# EAGLE design Motherboard V2 (EAGLE 6.6.0)
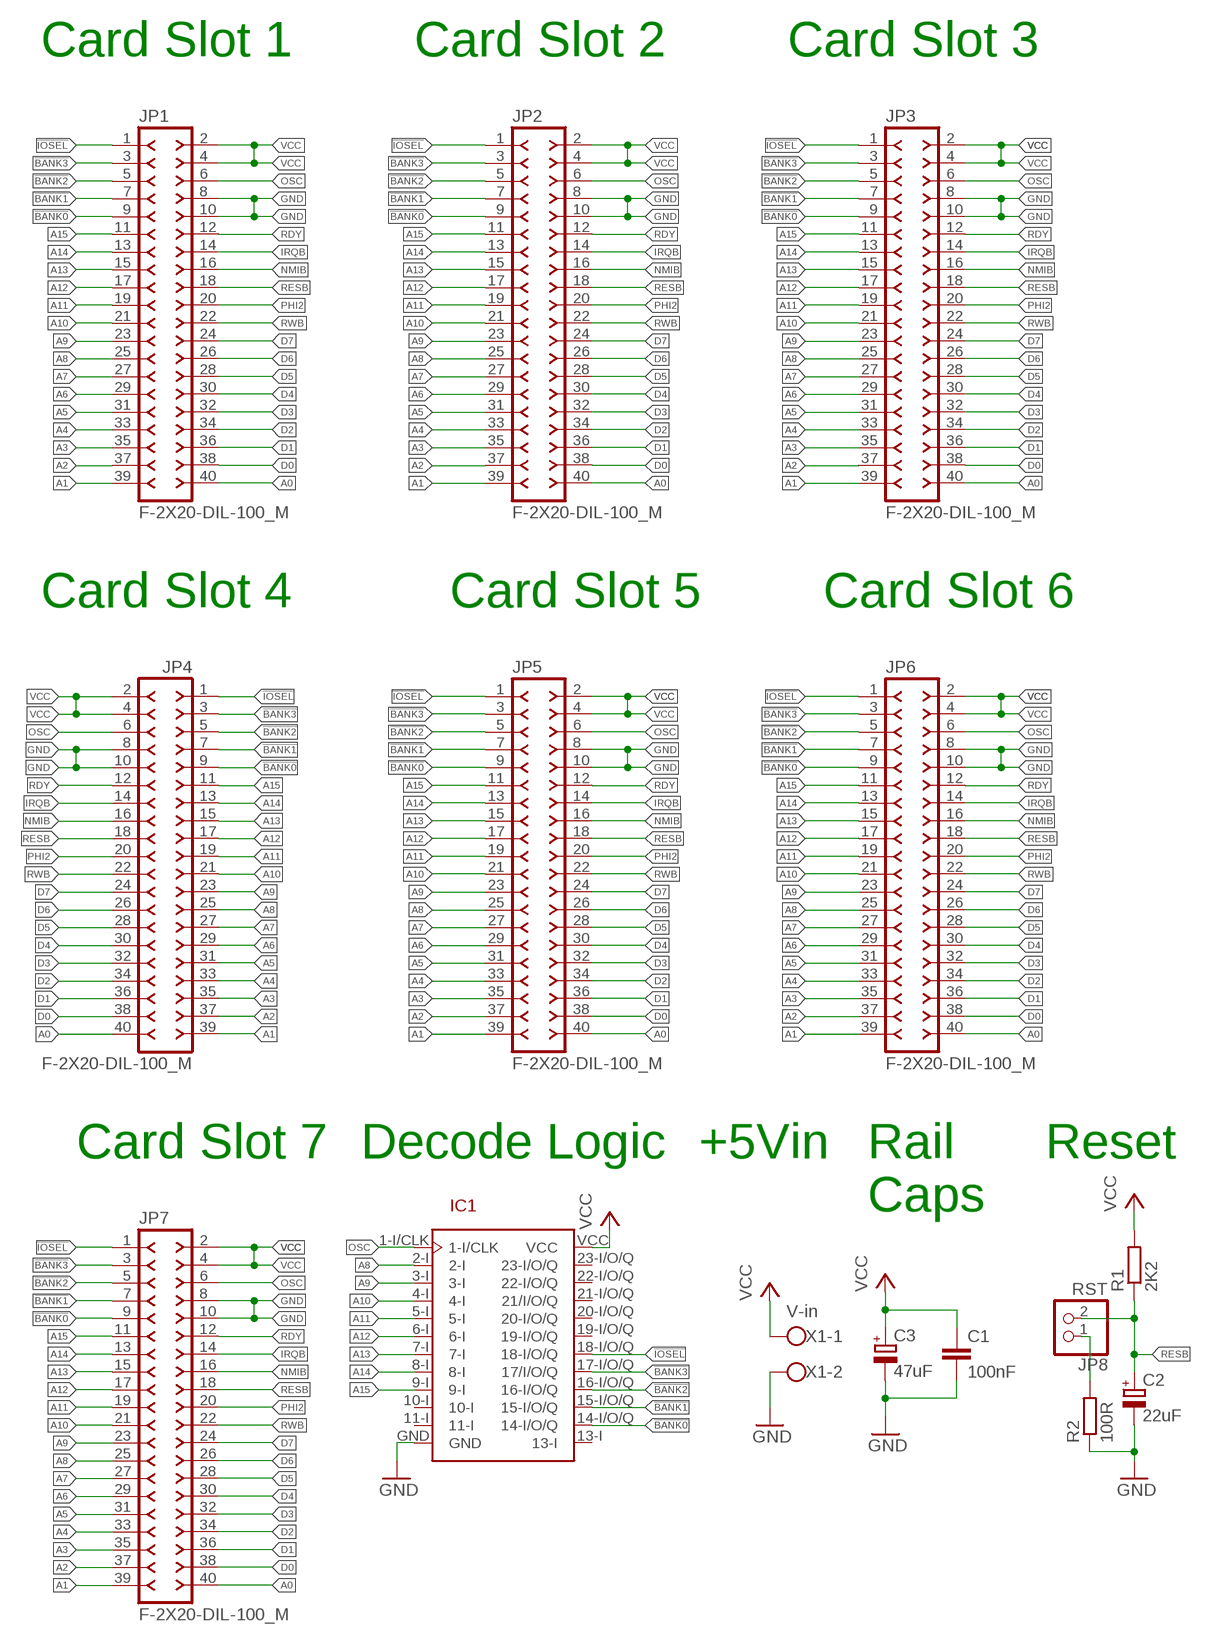
[diagram p0: schematic, sheet 1]

## Parts
C1  100nF  C-EU050-025X075  [C050-025X075]
C2  22uF  CPOL-EUE2-5  [E2-5]
C3  47uF  CPOL-EUE2.5-7  [E2,5-7]
IC1  GAL22V10D-DIP  [DIP24]
JP1  F-2X20-DIL-100_M  [DIL-100-2X20_M]
JP2  F-2X20-DIL-100_M  [DIL-100-2X20_M]
JP3  F-2X20-DIL-100_M  [DIL-100-2X20_M]
JP4  F-2X20-DIL-100_M  [DIL-100-2X20_M]
JP5  F-2X20-DIL-100_M  [DIL-100-2X20_M]
JP6  F-2X20-DIL-100_M  [DIL-100-2X20_M]
JP7  F-2X20-DIL-100_M  [DIL-100-2X20_M]
JP8  RST  PINHD-1X2  [1X02]
R1  2K2  R-EU_0207/10  [0207/10]
R2  100R  R-EU_0207/10  [0207/10]
X1  V-in  W237-102  [W237-102]

## Nets
!BANK0: IC1.14-I/O/Q JP1.9 JP2.9 JP3.9 JP4.9 JP5.9 JP6.9 JP7.9
!BANK1: IC1.15-I/O/Q JP1.7 JP2.7 JP3.7 JP4.7 JP5.7 JP6.7 JP7.7
!BANK2: IC1.16-I/O/Q JP1.5 JP2.5 JP3.5 JP4.5 JP5.5 JP6.5 JP7.5
!BANK3: IC1.17-I/O/Q(17/I/O/Q) JP1.3 JP2.3 JP3.3 JP4.3 JP5.3 JP6.3 JP7.3
!IOSEL: IC1.18-I/O/Q JP1.1 JP2.1 JP3.1 JP4.1 JP5.1 JP6.1 JP7.1
A0: JP1.40 JP2.40 JP3.40 JP4.40 JP5.40 JP6.40 JP7.40
A1: JP1.39 JP2.39 JP3.39 JP4.39 JP5.39 JP6.39 JP7.39
A2: JP1.37 JP2.37 JP3.37 JP4.37 JP5.37 JP6.37 JP7.37
A3: JP1.35 JP2.35 JP3.35 JP4.35 JP5.35 JP6.35 JP7.35
A4: JP1.33 JP2.33 JP3.33 JP4.33 JP5.33 JP6.33 JP7.33
A5: JP1.31 JP2.31 JP3.31 JP4.31 JP5.31 JP6.31 JP7.31
A6: JP1.29 JP2.29 JP3.29 JP4.29 JP5.29 JP6.29 JP7.29
A7: JP1.27 JP2.27 JP3.27 JP4.27 JP5.27 JP6.27 JP7.27
A8: IC1.2-I JP1.25 JP2.25 JP3.25 JP4.25 JP5.25 JP6.25 JP7.25
A9: IC1.3-I JP1.23 JP2.23 JP3.23 JP4.23 JP5.23 JP6.23 JP7.23
A10: IC1.4-I JP1.21 JP2.21 JP3.21 JP4.21 JP5.21 JP6.21 JP7.21
A11: IC1.5-I JP1.19 JP2.19 JP3.19 JP4.19 JP5.19 JP6.19 JP7.19
A12: IC1.6-I JP1.17 JP2.17 JP3.17 JP4.17 JP5.17 JP6.17 JP7.17
A13: IC1.7-I JP1.15 JP2.15 JP3.15 JP4.15 JP5.15 JP6.15 JP7.15
A14: IC1.8-I JP1.13 JP2.13 JP3.13 JP4.13 JP5.13 JP6.13 JP7.13
A15: IC1.9-I JP1.11 JP2.11 JP3.11 JP4.11 JP5.11 JP6.11 JP7.11
D0: JP1.38 JP2.38 JP3.38 JP4.38 JP5.38 JP6.38 JP7.38
D1: JP1.36 JP2.36 JP3.36 JP4.36 JP5.36 JP6.36 JP7.36
D2: JP1.34 JP2.34 JP3.34 JP4.34 JP5.34 JP6.34 JP7.34
D3: JP1.32 JP2.32 JP3.32 JP4.32 JP5.32 JP6.32 JP7.32
D4: JP1.30 JP2.30 JP3.30 JP4.30 JP5.30 JP6.30 JP7.30
D5: JP1.28 JP2.28 JP3.28 JP4.28 JP5.28 JP6.28 JP7.28
D6: JP1.26 JP2.26 JP3.26 JP4.26 JP5.26 JP6.26 JP7.26
D7: JP1.24 JP2.24 JP3.24 JP4.24 JP5.24 JP6.24 JP7.24
GND: C1.2 C2.- C3.- IC1.GND JP1.8 JP1.10 JP2.8 JP2.10 JP3.8 JP3.10 JP4.8 JP4.10 JP5.8 JP5.10 JP6.8 JP6.10 JP7.8 JP7.10 R2.1 X1.2
IRQB: JP1.14 JP2.14 JP3.14 JP4.14 JP5.14 JP6.14 JP7.14
N$1: JP8.1 R2.2
NMIB: JP1.16 JP2.16 JP3.16 JP4.16 JP5.16 JP6.16 JP7.16
OSC: IC1.1-I/CLK JP1.6 JP2.6 JP3.6 JP4.6 JP5.6 JP6.6 JP7.6
PHI2: JP1.20 JP2.20 JP3.20 JP4.20 JP5.20 JP6.20 JP7.20
RDY: JP1.12 JP2.12 JP3.12 JP4.12 JP5.12 JP6.12 JP7.12
RESB: C2.+ JP1.18 JP2.18 JP3.18 JP4.18 JP5.18 JP6.18 JP7.18 JP8.2 R1.1
RWB: JP1.22 JP2.22 JP3.22 JP4.22 JP5.22 JP6.22 JP7.22
VCC: C1.1 C3.+ IC1.VCC JP1.2 JP1.4 JP2.2 JP2.4 JP3.2 JP3.4 JP4.2 JP4.4 JP5.2 JP5.4 JP6.2 JP6.4 JP7.2 JP7.4 R1.2 X1.1
Unconnected: IC1.10-I IC1.11-I IC1.13-I IC1.19-I/O/Q IC1.20-I/O/Q IC1.21-I/O/Q(21/I/O/Q) IC1.22-I/O/Q IC1.23-I/O/Q

## Notes on the sheet
- Card Slot 1 | Card Slot 2 | Card Slot 3
- Card Slot 4 | Card Slot 5 | Card Slot 6
- Rail
  Caps
- Card Slot 7 | Decode Logic | +5Vin | Reset

## Library data of the parts
C1 = rcl:C-EU: CAPACITOR, European symbol
C2 C3 = rcl:CPOL-EU: POLARIZED CAPACITOR, European symbol
IC1 = GAL22V10D:GAL22V10D-DIP: GAL22V10 Generic Array Logic
JP1-JP7 = con-headers-jp:F-2X20-: FEMALE HEADER
JP8 = pinhead:PINHD-1X2: PIN HEADER
R1 R2 = rcl:R-EU_: RESISTOR, European symbol
X1 = con-wago-500:W237-102: WAGO SCREW CLAMP; MPN: 237-102; OC_FARNELL: unknown; OC_NEWARK: 70K9898

## Board
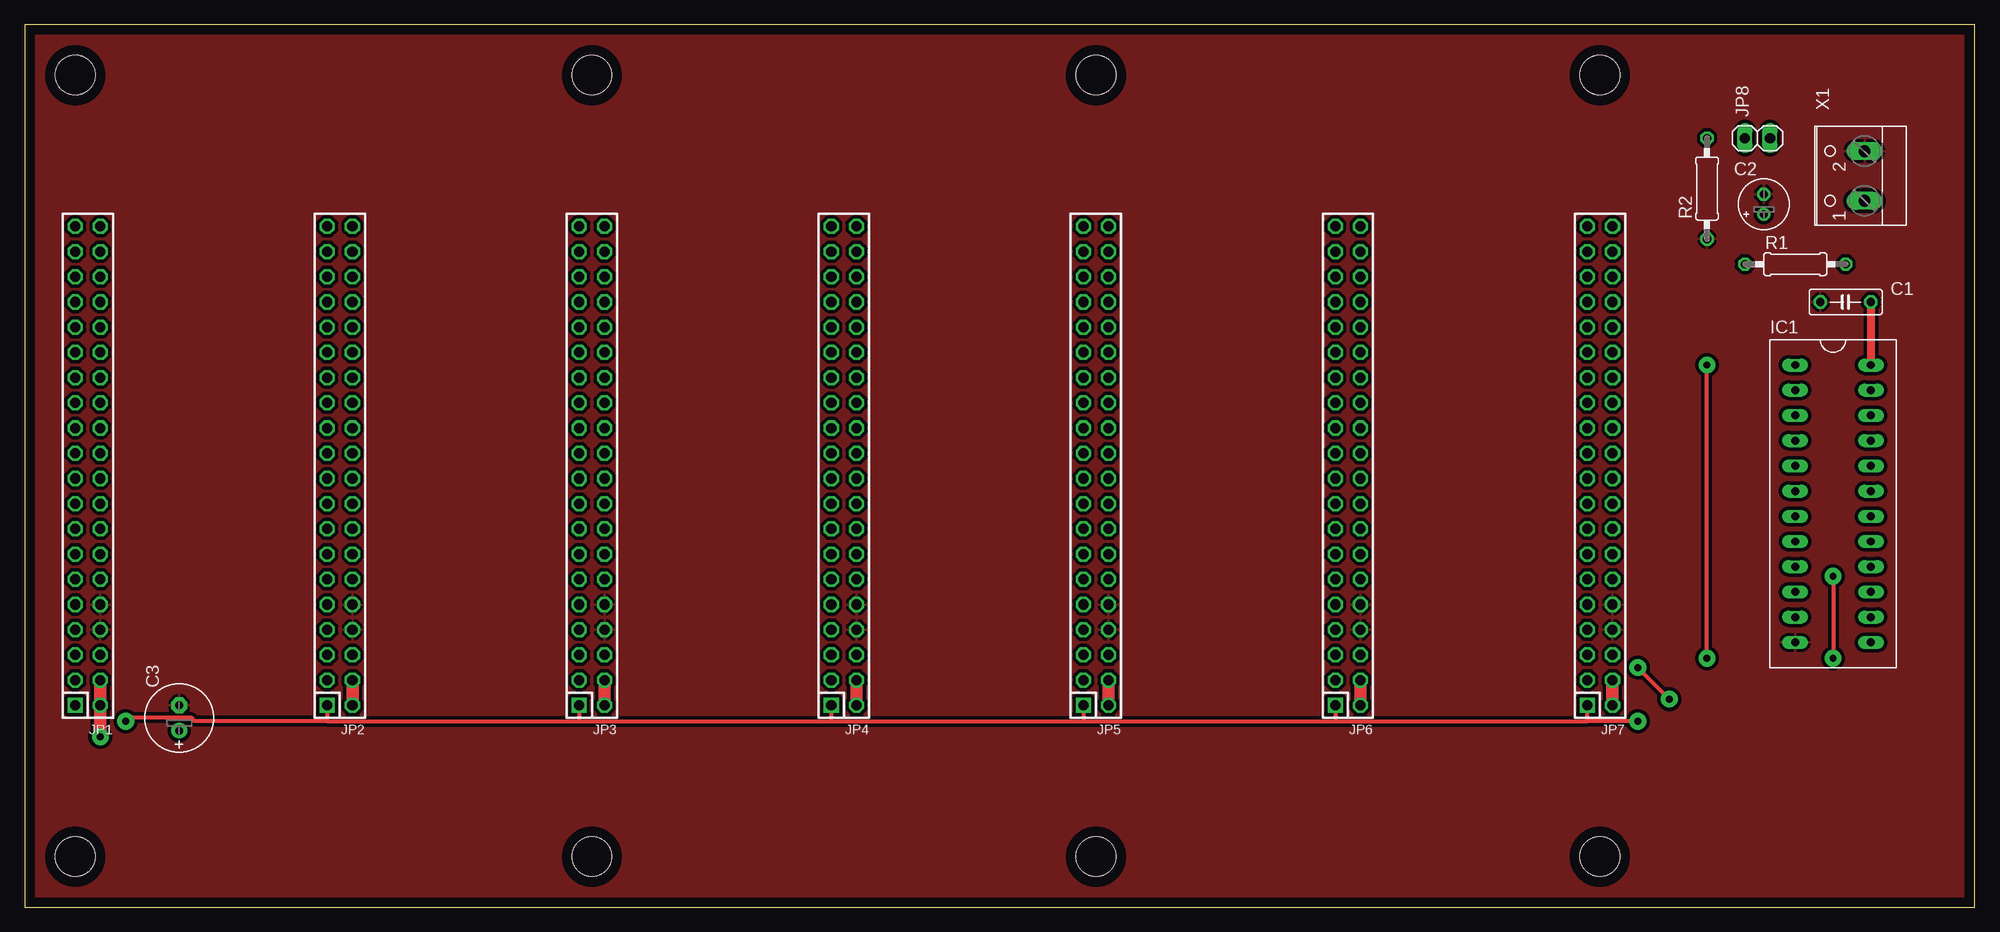
[diagram p1: board, top side]
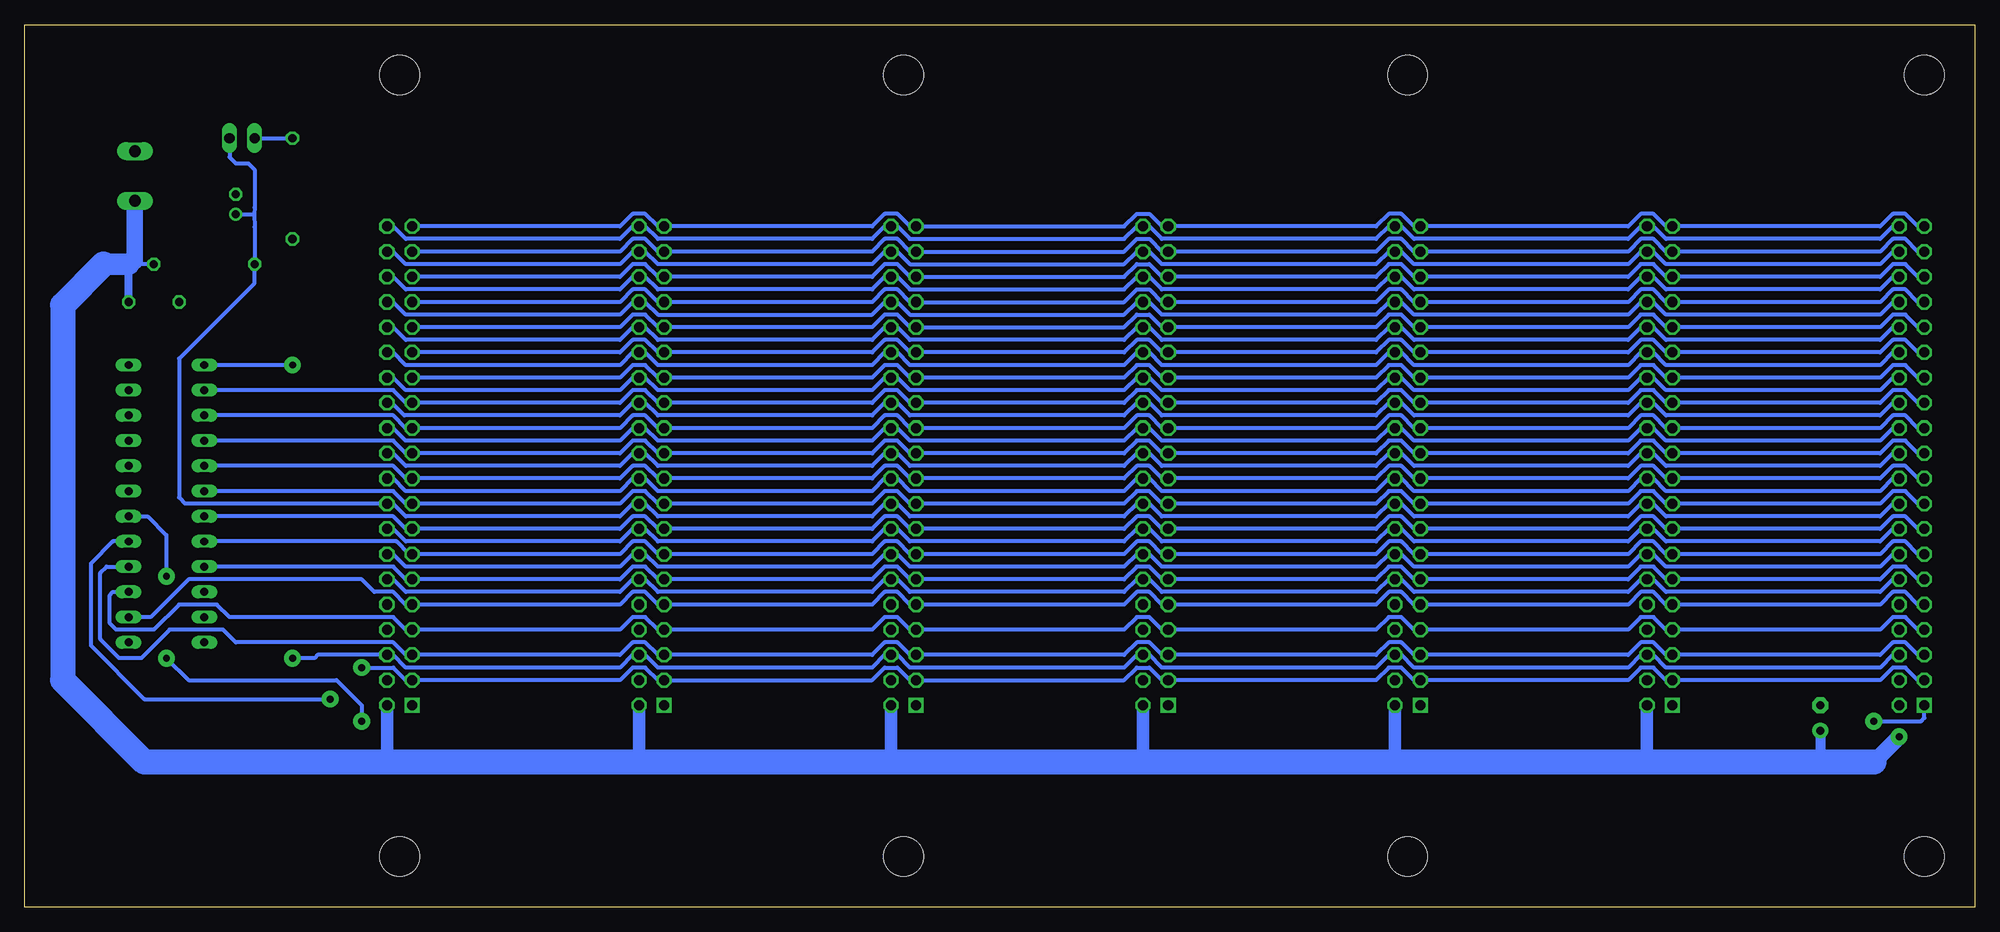
[diagram p2: board, bottom side, seen from below]

Size 196.52 x 88.89 mm. Coordinates in mm from the lower left corner, seen from the top.
Outline: 0,0 196.52,0 196.52,88.89 0,88.89 0,0
Copper layers (1*16): Top 0.035mm / dielectric 1.5mm / Bottom 0.035mm
Design rules "default *": minimum track width 10mil, minimum drill 24mil, track to track 8mil, track to pad 8mil, pad to pad 8mil, via to via 8mil, smd to smd 8mil, copper to edge 40mil, drill to drill 8mil, minimum pad ring 10mil, minimum via ring 8mil, stop-mask expansion 4mil, vias tented up to drill 0mil, thermal gap 12mil
Holes 4 mm at 5.08,5.08 5.08,83.82 158.75,83.82 158.75,5.08 57.15,5.08 57.15,83.82 107.95,5.08 107.95,83.82

### Footprints (pad centres in the part's own frame; a part is rotated, then mirrored left to right if it is on the bottom)
C050-025X075 = drill 0.813 octagon: 1 -2.54,0; 2 2.54,0
E2-5 = drill 0.813 pad 1.27: + -1.016,0 | drill 0.813 pad 1.27 octagon: - 1.016,0
E2,5-7 = drill 0.813 pad 1.6: + -1.27,0 | drill 0.813 pad 1.6 octagon: - 1.27,0
DIP24 = drill 0.8 long: 1-I/CLK -3.81,13.97; 2-I -3.81,11.43; 3-I -3.81,8.89; 4-I -3.81,6.35; 5-I -3.81,3.81; 6-I -3.81,1.27; 7-I -3.81,-1.27; 8-I -3.81,-3.81; 9-I -3.81,-6.35; 10-I -3.81,-8.89; 11-I -3.81,-11.43; 13-I 3.81,-13.97; 14-I/O/Q 3.81,-11.43; 15-I/O/Q 3.81,-8.89; 16-I/O/Q 3.81,-6.35; 17-I/O/Q 3.81,-3.81; 18-I/O/Q 3.81,-1.27; 19-I/O/Q 3.81,1.27; 20-I/O/Q 3.81,3.81; 21-I/O/Q 3.81,6.35; 22-I/O/Q 3.81,8.89; 23-I/O/Q 3.81,11.43; GND -3.81,-13.97; VCC 3.81,13.97
DIL-100-2X20_M = drill 1.016 square: 1 -24.13,1.27 | drill 1.016 octagon: 2 -24.13,-1.27; 3 -21.59,1.27; 4 -21.59,-1.27; 5 -19.05,1.27; 6 -19.05,-1.27; 7 -16.51,1.27; 8 -16.51,-1.27; 9 -13.97,1.27; 10 -13.97,-1.27; 11 -11.43,1.27; 12 -11.43,-1.27; 13 -8.89,1.27; 14 -8.89,-1.27; 15 -6.35,1.27; 16 -6.35,-1.27; 17 -3.81,1.27; 18 -3.81,-1.27; 19 -1.27,1.27; 20 -1.27,-1.27; 21 1.27,1.27; 22 1.27,-1.27; 23 3.81,1.27; 24 3.81,-1.27; 25 6.35,1.27; 26 6.35,-1.27; 27 8.89,1.27; 28 8.89,-1.27; 29 11.43,1.27; 30 11.43,-1.27; 31 13.97,1.27; 32 13.97,-1.27; 33 16.51,1.27; 34 16.51,-1.27; 35 19.05,1.27; 36 19.05,-1.27; 37 21.59,1.27; 38 21.59,-1.27; 39 24.13,1.27; 40 24.13,-1.27
1X02 = drill 1.016 long: 1 -1.27,0; 2 1.27,0
0207/10 = drill 0.813 octagon: 1 -5.08,0; 2 5.08,0
W237-102 = drill 1.194 long: 1 -2.5,-1.27; 2 2.5,-1.27

### Placement (x,y rotation side)
C1  183.51,60.96 180 top
C2  175.26,70.8 90 top
C3  15.56,19.05 90 top
IC1  182.25,40.64 0 top
JP1  6.35,44.45 90 top
JP2  31.75,44.45 90 top
JP3  57.15,44.45 90 top
JP4  82.55,44.45 90 top
JP5  107.95,44.45 90 top
JP6  133.35,44.45 90 top
JP7  158.75,44.45 90 top
JP8  174.62,77.47 0 top
R1  178.44,64.77 0 top
R2  169.54,72.39 90 top
X1  184.15,73.66 90 top

### Tracks (layer width: path | path; a pad name or v marks a point on that pad's centre or on a via)
!BANK0
  Bottom 0.406: IC1.14-I/O/Q 183.83,29.21 180.02,33.02 162.56,33.02 161.29,31.75 159.38,31.75 158.12,30.48 JP7.9 136.53,30.48 135.25,31.75 133.99,31.75 132.72,30.48 JP6.9 111.12,30.48 109.86,31.75 108.58,31.75 107.31,30.48 JP5.9 85.72,30.48 84.45,31.75 83.19,31.75 81.92,30.48 JP4.9 60.33,30.48 59.05,31.75 57.78,31.75 56.52,30.48 JP3.9 34.92,30.48 33.66,31.75 32.38,31.75 31.11,30.48 JP2.9 9.53,30.48 8.26,31.75 6.99,31.75 5.71,30.48 JP1.9
!BANK1
  Bottom 0.406: IC1.15-I/O/Q 187.64,31.75 187.96,31.43 187.96,28.57 187.32,27.94 183.51,27.94 180.97,30.48 177.16,30.48 175.9,29.21 159.38,29.21 158.12,27.94 JP7.7 136.53,27.94 135.25,29.21 133.99,29.21 132.72,27.94 JP6.7 111.12,27.94 109.86,29.21 108.58,29.21 107.31,27.94 JP5.7 85.72,27.94 84.45,29.21 83.19,29.21 81.92,27.94 JP4.7 60.33,27.94 59.05,29.21 57.78,29.21 56.52,27.94 JP3.7 34.92,27.94 33.66,29.21 32.38,29.21 31.11,27.94 JP2.7 9.53,27.94 8.26,29.21 6.99,29.21 5.71,27.94 JP1.7
!BANK2
  Bottom 0.406: IC1.16-I/O/Q 188.28,34.29 188.91,33.66 188.91,26.99 187.01,25.08 184.78,25.08 181.93,27.94 176.53,27.94 175.26,26.67 159.38,26.67 158.12,25.4 JP7.5 136.53,25.4 135.25,26.67 133.99,26.67 132.72,25.4 JP6.5 111.12,25.4 109.86,26.67 108.58,26.67 107.31,25.4 JP5.5 85.72,25.4 84.45,26.67 83.19,26.67 81.92,25.4 JP4.5 60.33,25.4 59.05,26.67 57.78,26.67 56.52,25.4 JP3.5 34.92,25.4 33.66,26.67 32.38,26.67 31.11,25.4 JP2.5 9.53,25.4 8.26,26.67 6.99,26.67 5.71,25.4 JP1.5
!BANK3  (via drill 0.7 pad 1.7)
  Top 0.406: v165.74,20.95 v162.56,24.13
  Bottom 0.406: JP1.3 5.71,22.86 6.99,24.13 8.26,24.13 9.53,22.86 JP2.3 31.11,22.86 32.38,24.13 33.66,24.13 34.92,22.86 JP3.3 56.52,22.86 57.78,24.13 59.05,24.13 60.33,22.86 JP4.3 81.92,22.86 83.19,24.13 84.45,24.13 85.72,22.86 JP5.3 107.31,22.86 108.58,24.13 109.86,24.13 111.12,22.86 JP6.3 132.72,22.86 133.99,24.13 135.25,24.13 136.53,22.86 JP7.3 158.12,22.86 159.38,24.13 v162.56,24.13 | IC1.17-I/O/Q 187.64,36.83 189.87,34.61 189.87,26.35 184.47,20.95 v165.74,20.95
!IOSEL  (via drill 0.7 pad 1.7)
  Top 0.406: JP2.1 30.48,18.73 | 30.48,18.73 55.88,18.73 | 55.88,18.73 81.28,18.73 | 81.28,18.73 106.68,18.73 | 106.68,18.73 132.08,18.73 | 132.08,18.73 157.48,18.73 | 157.48,18.73 JP7.1 | JP6.1 132.08,18.73 | JP5.1 106.68,18.73 | JP4.1 81.28,18.73 | JP3.1 55.88,18.73 | 30.48,18.73 17.14,18.73 16.83,19.05 10.48,19.05 v10.16,18.73 | v162.56,18.73 157.48,18.73 | v182.25,33.34 v182.25,25.08
  Bottom 0.406: v10.16,18.73 5.4,18.73 5.08,19.05 JP1.1 | v182.25,25.08 180.02,22.86 165.1,22.86 162.56,20.32 v162.56,18.73 | IC1.18-I/O/Q 184.15,39.37 182.25,37.47 v182.25,33.34
A0
  Bottom 0.406: JP1.40 8.26,68.58 9.53,67.31 31.11,67.31 32.38,68.58 JP2.40 33.66,68.58 34.92,67.31 56.52,67.31 57.78,68.58 JP3.40 59.05,68.58 60.33,67.31 81.92,67.31 83.19,68.58 JP4.40 84.45,68.58 85.72,67.31 107.31,67.31 108.58,68.58 JP5.40 109.86,68.58 111.12,67.31 132.72,67.31 133.99,68.58 JP6.40 135.25,68.58 136.53,67.31 158.12,67.31 159.38,68.58 JP7.40
A1
  Bottom 0.406: JP1.39 5.71,68.58 6.99,69.85 8.26,69.85 9.53,68.58 JP2.39 31.11,68.58 32.38,69.85 33.66,69.85 34.92,68.58 JP3.39 56.52,68.58 57.78,69.85 59.05,69.85 60.33,68.58 JP4.39 81.92,68.58 83.19,69.85 84.45,69.85 85.72,68.58 JP5.39 107.31,68.58 108.58,69.85 109.86,69.85 111.12,68.58 JP6.39 132.72,68.58 133.99,69.85 135.25,69.85 136.53,68.58 JP7.39
A2
  Bottom 0.406: JP1.37 5.71,66.04 6.99,67.31 8.26,67.31 9.53,66.04 JP2.37 31.11,66.04 32.38,67.31 33.66,67.31 34.92,66.04 JP3.37 56.52,66.04 57.78,67.31 59.05,67.31 60.33,66.04 JP4.37 81.92,66.04 83.19,67.31 84.45,67.31 85.72,66.04 JP5.37 107.31,66.04 108.58,67.31 109.86,67.31 111.12,66.04 JP6.37 132.72,66.04 133.99,67.31 135.25,67.31 136.53,66.04 JP7.37
A3
  Bottom 0.406: JP1.35 5.71,63.5 6.99,64.77 8.26,64.77 9.53,63.5 JP2.35 31.11,63.5 32.38,64.77 33.66,64.77 34.92,63.5 JP3.35 56.52,63.5 57.78,64.77 59.05,64.77 60.33,63.5 JP4.35 81.92,63.5 83.19,64.77 84.45,64.77 85.72,63.5 JP5.35 107.31,63.5 108.58,64.77 109.86,64.77 111.12,63.5 JP6.35 132.72,63.5 133.99,64.77 135.25,64.77 136.53,63.5 JP7.35
A4
  Bottom 0.406: JP1.33 5.71,60.96 6.99,62.23 8.26,62.23 9.53,60.96 JP2.33 31.11,60.96 32.38,62.23 33.66,62.23 34.92,60.96 JP3.33 56.52,60.96 57.78,62.23 59.05,62.23 60.33,60.96 JP4.33 81.92,60.96 83.19,62.23 84.45,62.23 85.72,60.96 JP5.33 107.31,60.96 108.58,62.23 109.86,62.23 111.12,60.96 JP6.33 132.72,60.96 133.99,62.23 135.25,62.23 136.53,60.96 JP7.33
A5
  Bottom 0.406: JP1.31 5.71,58.42 6.99,59.69 8.26,59.69 9.53,58.42 JP2.31 31.11,58.42 32.38,59.69 33.66,59.69 34.92,58.42 JP3.31 56.52,58.42 57.78,59.69 59.05,59.69 60.33,58.42 JP4.31 81.92,58.42 83.19,59.69 84.45,59.69 85.72,58.42 JP5.31 107.31,58.42 108.58,59.69 109.86,59.69 111.12,58.42 JP6.31 132.72,58.42 133.99,59.69 135.25,59.69 136.53,58.42 JP7.31
A6
  Bottom 0.406: JP1.29 5.71,55.88 6.99,57.15 8.26,57.15 9.53,55.88 JP2.29 31.11,55.88 32.38,57.15 33.66,57.15 34.92,55.88 JP3.29 56.52,55.88 57.78,57.15 59.05,57.15 60.33,55.88 JP4.29 81.92,55.88 83.19,57.15 84.45,57.15 85.72,55.88 JP5.29 107.31,55.88 108.58,57.15 109.86,57.15 111.12,55.88 JP6.29 132.72,55.88 133.99,57.15 135.25,57.15 136.53,55.88 JP7.29
A7
  Bottom 0.406: JP1.27 5.71,53.34 6.99,54.61 8.26,54.61 9.53,53.34 JP2.27 31.11,53.34 32.38,54.61 33.66,54.61 34.92,53.34 JP3.27 56.52,53.34 57.78,54.61 59.05,54.61 60.33,53.34 JP4.27 81.92,53.34 83.19,54.61 84.45,54.61 85.72,53.34 JP5.27 107.31,53.34 108.58,54.61 109.86,54.61 111.12,53.34 JP6.27 132.72,53.34 133.99,54.61 135.25,54.61 136.53,53.34 JP7.27
A8
  Bottom 0.406: JP1.25 5.71,50.8 6.99,52.07 8.26,52.07 9.53,50.8 JP2.25 31.11,50.8 32.38,52.07 33.66,52.07 34.92,50.8 JP3.25 56.52,50.8 57.78,52.07 59.05,52.07 60.33,50.8 JP4.25 81.92,50.8 83.19,52.07 84.45,52.07 85.72,50.8 JP5.25 107.31,50.8 108.58,52.07 109.86,52.07 111.12,50.8 JP6.25 132.72,50.8 133.99,52.07 135.25,52.07 136.53,50.8 JP7.25 158.12,50.8 159.38,52.07 IC1.2-I
A9
  Bottom 0.406: JP1.23 5.71,48.26 6.99,49.53 8.26,49.53 9.53,48.26 JP2.23 31.11,48.26 32.38,49.53 33.66,49.53 34.92,48.26 JP3.23 56.52,48.26 57.78,49.53 59.05,49.53 60.33,48.26 JP4.23 81.92,48.26 83.19,49.53 84.45,49.53 85.72,48.26 JP5.23 107.31,48.26 108.58,49.53 109.86,49.53 111.12,48.26 JP6.23 132.72,48.26 133.99,49.53 135.25,49.53 136.53,48.26 JP7.23 158.12,48.26 159.38,49.53 IC1.3-I
A10
  Bottom 0.406: JP1.21 5.71,45.72 6.99,46.99 8.26,46.99 9.53,45.72 JP2.21 31.11,45.72 32.38,46.99 33.66,46.99 34.92,45.72 JP3.21 56.52,45.72 57.78,46.99 59.05,46.99 60.33,45.72 JP4.21 81.92,45.72 83.19,46.99 84.45,46.99 85.72,45.72 JP5.21 107.31,45.72 108.58,46.99 109.86,46.99 111.12,45.72 JP6.21 132.72,45.72 133.99,46.99 135.25,46.99 136.53,45.72 JP7.21 158.12,45.72 159.38,46.99 IC1.4-I
A11
  Bottom 0.406: JP1.19 5.71,43.18 6.99,44.45 8.26,44.45 9.53,43.18 JP2.19 31.11,43.18 32.38,44.45 33.66,44.45 34.92,43.18 JP3.19 56.52,43.18 57.78,44.45 59.05,44.45 60.33,43.18 JP4.19 81.92,43.18 83.19,44.45 84.45,44.45 85.72,43.18 JP5.19 107.31,43.18 108.58,44.45 109.86,44.45 111.12,43.18 JP6.19 132.72,43.18 133.99,44.45 135.25,44.45 136.53,43.18 JP7.19 158.12,43.18 159.38,44.45 IC1.5-I
A12
  Bottom 0.406: JP1.17 5.71,40.64 6.99,41.91 8.26,41.91 9.53,40.64 JP2.17 31.11,40.64 32.38,41.91 33.66,41.91 34.92,40.64 JP3.17 56.52,40.64 57.78,41.91 59.05,41.91 60.33,40.64 JP4.17 81.92,40.64 83.19,41.91 84.45,41.91 85.72,40.64 JP5.17 107.31,40.64 108.58,41.91 109.86,41.91 111.12,40.64 JP6.17 132.72,40.64 133.99,41.91 135.25,41.91 136.53,40.64 JP7.17 158.12,40.64 159.38,41.91 IC1.6-I
A13
  Bottom 0.406: JP1.15 5.71,38.1 6.99,39.37 8.26,39.37 9.53,38.1 JP2.15 31.11,38.1 32.38,39.37 33.66,39.37 34.92,38.1 JP3.15 56.52,38.1 57.78,39.37 59.05,39.37 60.33,38.1 JP4.15 81.92,38.1 83.19,39.37 84.45,39.37 85.72,38.1 JP5.15 107.31,38.1 108.58,39.37 109.86,39.37 111.12,38.1 JP6.15 132.72,38.1 133.99,39.37 135.25,39.37 136.53,38.1 JP7.15 158.12,38.1 159.38,39.37 IC1.7-I
A14
  Bottom 0.406: JP1.13 5.71,35.56 6.99,36.83 8.26,36.83 9.53,35.56 JP2.13 31.11,35.56 32.38,36.83 33.66,36.83 34.92,35.56 JP3.13 56.52,35.56 57.78,36.83 59.05,36.83 60.33,35.56 JP4.13 81.92,35.56 83.19,36.83 84.45,36.83 85.72,35.56 JP5.13 107.31,35.56 108.58,36.83 109.86,36.83 111.12,35.56 JP6.13 132.72,35.56 133.99,36.83 135.25,36.83 136.53,35.56 JP7.13 157.8,35.56 159.07,36.83 IC1.8-I
A15
  Bottom 0.406: JP1.11 5.71,33.02 6.99,34.29 8.26,34.29 9.53,33.02 JP2.11 31.11,33.02 32.38,34.29 33.66,34.29 34.92,33.02 JP3.11 56.52,33.02 57.78,34.29 59.05,34.29 60.33,33.02 JP4.11 81.92,33.02 83.19,34.29 84.45,34.29 85.72,33.02 JP5.11 107.31,33.02 108.58,34.29 109.86,34.29 111.12,33.02 JP6.11 132.72,33.02 133.99,34.29 135.25,34.29 136.53,33.02 JP7.11 158.12,33.02 159.38,34.29 IC1.9-I
D0
  Bottom 0.406: JP1.38 8.26,66.04 9.53,64.77 31.11,64.77 32.38,66.04 JP2.38 33.66,66.04 34.92,64.77 56.52,64.77 57.78,66.04 JP3.38 59.05,66.04 60.33,64.77 81.92,64.77 83.19,66.04 JP4.38 84.45,66.04 85.72,64.77 107.31,64.77 108.58,66.04 JP5.38 109.86,66.04 111.12,64.77 132.72,64.77 133.99,66.04 JP6.38 135.25,66.04 136.53,64.77 158.12,64.77 159.38,66.04 JP7.38
D1
  Bottom 0.406: JP1.36 8.26,63.5 9.53,62.23 31.11,62.23 32.38,63.5 JP2.36 33.66,63.5 34.92,62.23 56.52,62.23 57.78,63.5 JP3.36 59.05,63.5 60.33,62.23 81.92,62.23 83.19,63.5 JP4.36 84.45,63.5 85.72,62.23 107.31,62.23 108.58,63.5 JP5.36 109.86,63.5 111.12,62.23 132.72,62.23 133.99,63.5 JP6.36 135.25,63.5 136.53,62.23 158.12,62.23 159.38,63.5 JP7.36
D2
  Bottom 0.406: JP1.34 8.26,60.96 9.53,59.69 31.11,59.69 32.38,60.96 JP2.34 33.66,60.96 34.92,59.69 56.52,59.69 57.78,60.96 JP3.34 59.05,60.96 60.33,59.69 81.92,59.69 83.19,60.96 JP4.34 84.45,60.96 85.72,59.69 107.31,59.69 108.58,60.96 JP5.34 109.86,60.96 111.12,59.69 132.72,59.69 133.99,60.96 JP6.34 135.25,60.96 136.53,59.69 158.12,59.69 159.38,60.96 JP7.34
D3
  Bottom 0.406: JP1.32 8.26,58.42 9.53,57.15 31.11,57.15 32.38,58.42 JP2.32 33.66,58.42 34.92,57.15 56.52,57.15 57.78,58.42 JP3.32 59.05,58.42 60.33,57.15 81.92,57.15 83.19,58.42 JP4.32 84.45,58.42 85.72,57.15 107.31,57.15 108.58,58.42 JP5.32 109.86,58.42 111.12,57.15 132.72,57.15 133.99,58.42 JP6.32 135.25,58.42 136.53,57.15 158.12,57.15 159.38,58.42 JP7.32
D4
  Bottom 0.406: JP1.30 8.26,55.88 9.53,54.61 31.11,54.61 32.38,55.88 JP2.30 33.66,55.88 34.92,54.61 56.52,54.61 57.78,55.88 JP3.30 59.05,55.88 60.33,54.61 81.92,54.61 83.19,55.88 JP4.30 84.45,55.88 85.72,54.61 107.31,54.61 108.58,55.88 JP5.30 109.86,55.88 111.12,54.61 132.72,54.61 133.99,55.88 JP6.30 135.25,55.88 136.53,54.61 158.12,54.61 159.38,55.88 JP7.30
D5
  Bottom 0.406: JP1.28 8.26,53.34 9.53,52.07 31.11,52.07 32.38,53.34 JP2.28 33.66,53.34 34.92,52.07 56.52,52.07 57.78,53.34 JP3.28 59.05,53.34 60.33,52.07 81.92,52.07 83.19,53.34 JP4.28 84.45,53.34 85.72,52.07 107.31,52.07 108.58,53.34 JP5.28 109.86,53.34 111.12,52.07 132.72,52.07 133.99,53.34 JP6.28 135.25,53.34 136.53,52.07 158.12,52.07 159.38,53.34 JP7.28
D6
  Bottom 0.406: JP1.26 8.26,50.8 9.53,49.53 31.11,49.53 32.38,50.8 JP2.26 33.66,50.8 34.92,49.53 56.52,49.53 57.78,50.8 JP3.26 59.05,50.8 60.33,49.53 81.92,49.53 83.19,50.8 JP4.26 84.45,50.8 85.72,49.53 107.31,49.53 108.58,50.8 JP5.26 109.86,50.8 111.12,49.53 132.72,49.53 133.99,50.8 JP6.26 135.25,50.8 136.53,49.53 158.27,49.53 159.54,50.8 JP7.26
D7
  Bottom 0.406: JP1.24 8.26,48.26 9.53,46.99 31.11,46.99 32.38,48.26 JP2.24 33.66,48.26 34.92,46.99 56.52,46.99 57.78,48.26 JP3.24 59.05,48.26 60.33,46.99 81.92,46.99 83.19,48.26 JP4.24 84.45,48.26 85.72,46.99 107.31,46.99 108.58,48.26 JP5.24 109.86,48.26 111.12,46.99 132.72,46.99 133.99,48.26 JP6.24 135.25,48.26 136.53,46.99 158.12,46.99 159.38,48.26 JP7.24
GND
  pour Top (isolate 0.356): 196.53,88.9 196.53,0 0,0 0,88.9
IRQB
  Bottom 0.406: JP1.14 8.26,35.56 9.53,34.29 31.11,34.29 32.38,35.56 JP2.14 33.66,35.56 34.92,34.29 56.52,34.29 57.78,35.56 JP3.14 59.05,35.56 60.33,34.29 81.92,34.29 83.19,35.56 JP4.14 84.45,35.56 85.72,34.29 107.31,34.29 108.58,35.56 JP5.14 109.86,35.56 111.12,34.29 132.72,34.29 133.99,35.56 JP6.14 135.25,35.56 136.53,34.29 158.12,34.29 159.38,35.56 JP7.14
N$1
  Bottom 0.406: JP8.1 R2.2
NMIB
  Bottom 0.406: JP1.16 8.26,38.1 9.53,36.83 31.11,36.83 32.38,38.1 JP2.16 33.66,38.1 34.92,36.83 56.52,36.83 57.78,38.1 JP3.16 59.05,38.1 60.33,36.83 81.92,36.83 83.19,38.1 JP4.16 84.45,38.1 85.72,36.83 107.31,36.83 108.58,38.1 JP5.16 109.86,38.1 111.12,36.83 132.72,36.83 133.99,38.1 JP6.16 135.25,38.1 136.53,36.83 158.12,36.83 159.38,38.1 JP7.16
OSC  (via drill 0.7 pad 1.7)
  Top 0.406: v169.54,25.08 v169.54,54.61
  Bottom 0.254: 32.38,25.4 JP2.6 33.66,25.4
  Bottom 0.406: JP1.6 8.26,25.4 9.53,24.13 31.11,24.13 32.38,25.4 | 33.66,25.4 34.92,24.13 56.52,24.13 57.78,25.4 JP3.6 59.05,25.4 60.33,24.13 81.92,24.13 83.19,25.4 JP4.6 84.45,25.4 85.72,24.13 107.31,24.13 108.58,25.4 JP5.6 109.86,25.4 111.12,24.13 132.72,24.13 133.99,25.4 JP6.6 135.25,25.4 136.53,24.13 158.12,24.13 159.38,25.4 JP7.6 167,25.4 167.32,25.08 v169.54,25.08 | v169.54,54.61 IC1.1-I/CLK
PHI2
  Bottom 0.254: 8.26,43.18 JP1.20 | 57.78,43.18 JP3.20 59.05,43.18
  Bottom 0.406: 59.05,43.18 60.33,41.91 81.92,41.91 83.19,43.18 JP4.20 84.45,43.18 85.72,41.91 107.31,41.91 108.58,43.18 JP5.20 109.86,43.18 111.12,41.91 132.72,41.91 133.99,43.18 JP6.20 135.25,43.18 136.53,41.91 158.12,41.91 159.38,43.18 JP7.20 | 8.26,43.18 9.53,41.91 31.11,41.91 32.38,43.18 JP2.20 33.66,43.18 34.92,41.91 56.52,41.91 57.78,43.18
RDY
  Bottom 0.406: JP1.12 8.26,33.02 9.53,31.75 31.11,31.75 32.38,33.02 JP2.12 33.66,33.02 34.92,31.75 56.52,31.75 57.78,33.02 JP3.12 59.05,33.02 60.33,31.75 81.92,31.75 83.19,33.02 JP4.12 84.45,33.02 85.72,31.75 107.31,31.75 108.58,33.02 JP5.12 109.86,33.02 111.12,31.75 132.72,31.75 133.99,33.02 JP6.12 135.25,33.02 136.53,31.75 158.12,31.75 159.38,33.02 JP7.12
RESB
  Bottom 0.406: C2.+ 173.39,69.82 | 173.39,69.82 173.35,68.52 R1.1 173.35,62.87 180.97,55.24 180.97,41.27 180.34,40.64 JP7.18 159.38,40.64 158.12,39.37 136.53,39.37 135.25,40.64 JP6.18 133.99,40.64 132.72,39.37 111.12,39.37 109.86,40.64 JP5.18 108.58,40.64 107.31,39.37 85.72,39.37 84.45,40.64 JP4.18 83.19,40.64 81.92,39.37 60.33,39.37 59.05,40.64 JP3.18 57.78,40.64 56.52,39.37 34.92,39.37 33.66,40.64 JP2.18 32.38,40.64 31.11,39.37 9.53,39.37 8.26,40.64 JP1.18 | JP8.2 175.9,75.56 175.26,74.93 173.99,74.93 173.35,74.3 173.35,70.48 173.39,69.82
RWB
  Bottom 0.406: JP1.22 8.26,45.72 9.53,44.45 31.11,44.45 32.38,45.72 JP2.22 33.66,45.72 34.92,44.45 56.52,44.45 57.78,45.72 JP3.22 59.05,45.72 60.33,44.45 81.92,44.45 83.19,45.72 JP4.22 84.45,45.72 85.72,44.45 107.31,44.45 108.58,45.72 JP5.22 109.86,45.72 111.12,44.45 132.72,44.45 133.99,45.72 JP6.22 135.25,45.72 136.53,44.45 158.12,44.45 159.38,45.72 JP7.22
VCC  (via drill 0.7 pad 1.7)
  Top 0.813: C1.1 185.74,60.96 186.06,60.64 IC1.VCC
  Top 1.27: v7.62,17.14 JP1.2 JP1.4 | JP3.4 JP3.2 | JP2.4 JP2.2 | JP6.4 JP6.2 | JP5.2 JP5.4 | JP4.2 JP4.4 | JP7.4 JP7.2
  Bottom 0.406: R1.2 185.74,64.77
  Bottom 0.813: C1.1 186.06,64.77
  Bottom 1.016: C3.+ 15.56,14.61
  Bottom 1.27: 186.06,64.77 185.74,64.77 185.42,65.09 | JP3.2 58.42,14.61 | JP2.2 33.02,14.61 | JP6.2 134.62,14.61 | JP4.2 83.82,14.61 | JP5.2 109.22,14.61 | JP7.2 160.02,14.61
  Bottom 1.676: 10.16,14.61 v7.62,17.14 | X1.1 185.42,65.09
  Bottom 2.184: 186.06,64.77 188.59,64.77
  Bottom 2.54: 10.16,14.61 15.56,14.61 33.02,14.61 58.42,14.61 83.82,14.61 109.22,14.61 134.62,14.61 160.02,14.61 184.47,14.61 192.72,22.86 192.72,60.64 188.59,64.77

### Text on the board
tValues: - | Backplane V2.1 extended. | + | Top of case